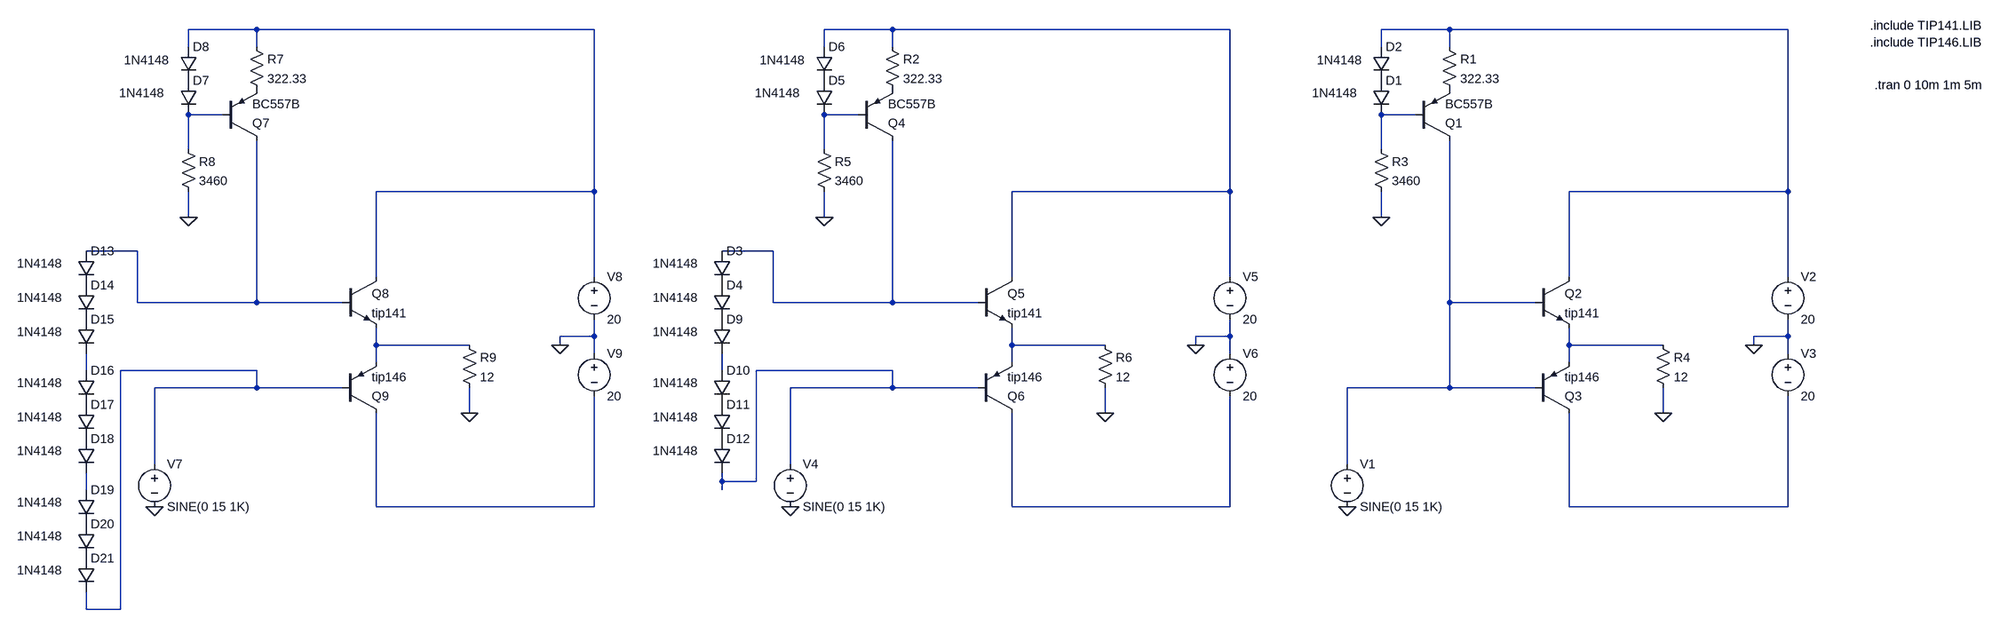
[diagram p0: schematic COMPARACION_DIODOS.asc]
COMPARACION_DIODOS.asc, the LTspice schematic file:
Version 4
SHEET 1 880 680
WIRE -3232 -512 -3360 -512
WIRE -2512 -512 -3232 -512
WIRE -1952 -512 -2080 -512
WIRE -1232 -512 -1952 -512
WIRE -688 -512 -816 -512
WIRE 32 -512 -688 -512
WIRE -3360 -480 -3360 -512
WIRE -3232 -480 -3232 -512
WIRE -2080 -480 -2080 -512
WIRE -1952 -480 -1952 -512
WIRE -816 -480 -816 -512
WIRE -688 -480 -688 -512
WIRE -3296 -352 -3360 -352
WIRE -2016 -352 -2080 -352
WIRE -752 -352 -816 -352
WIRE -3360 -288 -3360 -352
WIRE -2080 -288 -2080 -352
WIRE -816 -288 -816 -352
WIRE -2512 -208 -2512 -512
WIRE -2512 -208 -3008 -208
WIRE -1232 -208 -1232 -512
WIRE -1232 -208 -1728 -208
WIRE 32 -208 32 -512
WIRE 32 -208 -464 -208
WIRE -3360 -160 -3360 -208
WIRE -2080 -160 -2080 -208
WIRE -816 -160 -816 -208
WIRE -3456 -96 -3552 -96
WIRE -2176 -96 -2272 -96
WIRE -3008 -48 -3008 -208
WIRE -2512 -48 -2512 -208
WIRE -1728 -48 -1728 -208
WIRE -1232 -48 -1232 -208
WIRE -464 -48 -464 -208
WIRE 32 -48 32 -208
WIRE -3456 0 -3456 -96
WIRE -3232 0 -3232 -304
WIRE -3232 0 -3456 0
WIRE -3072 0 -3232 0
WIRE -2176 0 -2176 -96
WIRE -1952 0 -1952 -304
WIRE -1952 0 -2176 0
WIRE -1792 0 -1952 0
WIRE -688 0 -688 -304
WIRE -528 0 -688 0
WIRE -2512 64 -2512 32
WIRE -2512 64 -2576 64
WIRE -1232 64 -1232 32
WIRE -1232 64 -1296 64
WIRE 32 64 32 32
WIRE 32 64 -32 64
WIRE -3008 80 -3008 48
WIRE -2816 80 -3008 80
WIRE -2576 80 -2576 64
WIRE -1728 80 -1728 48
WIRE -1536 80 -1728 80
WIRE -1296 80 -1296 64
WIRE -464 80 -464 48
WIRE -272 80 -464 80
WIRE -32 80 -32 64
WIRE -2512 96 -2512 64
WIRE -1232 96 -1232 64
WIRE 32 96 32 64
WIRE -3008 112 -3008 80
WIRE -1728 112 -1728 80
WIRE -464 112 -464 80
WIRE -3552 128 -3552 96
WIRE -3232 128 -3488 128
WIRE -2272 128 -2272 96
WIRE -1952 128 -2208 128
WIRE -3232 160 -3232 128
WIRE -3232 160 -3424 160
WIRE -3072 160 -3232 160
WIRE -1952 160 -1952 128
WIRE -1952 160 -2144 160
WIRE -1792 160 -1952 160
WIRE -688 160 -688 0
WIRE -688 160 -880 160
WIRE -528 160 -688 160
WIRE -2816 208 -2816 160
WIRE -1536 208 -1536 160
WIRE -272 208 -272 160
WIRE -3424 304 -3424 160
WIRE -2144 304 -2144 160
WIRE -880 304 -880 160
WIRE -2272 336 -2272 320
WIRE -2208 336 -2208 128
WIRE -2208 336 -2272 336
WIRE -3552 352 -3552 320
WIRE -2272 352 -2272 336
WIRE -3008 384 -3008 208
WIRE -2512 384 -2512 176
WIRE -2512 384 -3008 384
WIRE -1728 384 -1728 208
WIRE -1232 384 -1232 176
WIRE -1232 384 -1728 384
WIRE -464 384 -464 208
WIRE 32 384 32 176
WIRE 32 384 -464 384
WIRE -3552 576 -3552 544
WIRE -3488 576 -3488 128
WIRE -3488 576 -3552 576
FLAG -816 -160 0
FLAG -880 384 0
FLAG -32 80 0
FLAG -272 208 0
FLAG -2080 -160 0
FLAG -2144 384 0
FLAG -1296 80 0
FLAG -1536 208 0
FLAG -3360 -160 0
FLAG -3424 384 0
FLAG -2576 80 0
FLAG -2816 208 0
SYMBOL diode -832 -416 R0
WINDOW 3 -114 23 Left 2
SYMATTR InstName D1
SYMATTR Value 1N4148
SYMBOL diode -832 -480 R0
WINDOW 3 -105 25 Left 2
SYMATTR InstName D2
SYMATTR Value 1N4148
SYMBOL res -704 -496 R0
SYMATTR InstName R1
SYMATTR Value 322.33
SYMBOL res -832 -304 R0
SYMATTR InstName R3
SYMATTR Value 3460
SYMBOL pnp -752 -304 M180
SYMATTR InstName Q1
SYMATTR Value BC557B
SYMBOL npn -528 -48 R0
SYMATTR InstName Q2
SYMATTR Value tip141
SYMATTR Prefix X
SYMBOL pnp -528 208 M180
SYMATTR InstName Q3
SYMATTR Value tip146
SYMATTR Prefix X
SYMBOL voltage -880 288 R0
WINDOW 123 0 0 Left 0
WINDOW 39 0 0 Left 0
SYMATTR InstName V1
SYMATTR Value SINE(0 15 1K)
SYMBOL voltage 32 -64 R0
WINDOW 123 0 0 Left 0
WINDOW 39 0 0 Left 0
SYMATTR InstName V2
SYMATTR Value 20
SYMBOL voltage 32 80 R0
WINDOW 123 0 0 Left 0
WINDOW 39 0 0 Left 0
SYMATTR InstName V3
SYMATTR Value 20
SYMBOL res -288 64 R0
SYMATTR InstName R4
SYMATTR Value 12
SYMBOL diode -2096 -416 R0
WINDOW 3 -114 23 Left 2
SYMATTR InstName D5
SYMATTR Value 1N4148
SYMBOL diode -2096 -480 R0
WINDOW 3 -105 25 Left 2
SYMATTR InstName D6
SYMATTR Value 1N4148
SYMBOL res -1968 -496 R0
SYMATTR InstName R2
SYMATTR Value 322.33
SYMBOL res -2096 -304 R0
SYMATTR InstName R5
SYMATTR Value 3460
SYMBOL pnp -2016 -304 M180
SYMATTR InstName Q4
SYMATTR Value BC557B
SYMBOL npn -1792 -48 R0
SYMATTR InstName Q5
SYMATTR Value tip141
SYMATTR Prefix X
SYMBOL pnp -1792 208 M180
SYMATTR InstName Q6
SYMATTR Value tip146
SYMATTR Prefix X
SYMBOL voltage -2144 288 R0
WINDOW 123 0 0 Left 0
WINDOW 39 0 0 Left 0
SYMATTR InstName V4
SYMATTR Value SINE(0 15 1K)
SYMBOL voltage -1232 -64 R0
WINDOW 123 0 0 Left 0
WINDOW 39 0 0 Left 0
SYMATTR InstName V5
SYMATTR Value 20
SYMBOL voltage -1232 80 R0
WINDOW 123 0 0 Left 0
WINDOW 39 0 0 Left 0
SYMATTR InstName V6
SYMATTR Value 20
SYMBOL res -1552 64 R0
SYMATTR InstName R6
SYMATTR Value 12
SYMBOL diode -2288 -96 R0
WINDOW 3 -114 23 Left 2
SYMATTR InstName D3
SYMATTR Value 1N4148
SYMBOL diode -2288 -32 R0
WINDOW 3 -114 23 Left 2
SYMATTR InstName D4
SYMATTR Value 1N4148
SYMBOL diode -2288 32 R0
WINDOW 3 -114 23 Left 2
SYMATTR InstName D9
SYMATTR Value 1N4148
SYMBOL diode -2288 128 R0
WINDOW 3 -114 23 Left 2
SYMATTR InstName D10
SYMATTR Value 1N4148
SYMBOL diode -2288 192 R0
WINDOW 3 -114 23 Left 2
SYMATTR InstName D11
SYMATTR Value 1N4148
SYMBOL diode -2288 256 R0
WINDOW 3 -114 23 Left 2
SYMATTR InstName D12
SYMATTR Value 1N4148
SYMBOL diode -3376 -416 R0
WINDOW 3 -114 23 Left 2
SYMATTR InstName D7
SYMATTR Value 1N4148
SYMBOL diode -3376 -480 R0
WINDOW 3 -105 25 Left 2
SYMATTR InstName D8
SYMATTR Value 1N4148
SYMBOL res -3248 -496 R0
SYMATTR InstName R7
SYMATTR Value 322.33
SYMBOL res -3376 -304 R0
SYMATTR InstName R8
SYMATTR Value 3460
SYMBOL pnp -3296 -304 M180
SYMATTR InstName Q7
SYMATTR Value BC557B
SYMBOL npn -3072 -48 R0
SYMATTR InstName Q8
SYMATTR Value tip141
SYMATTR Prefix X
SYMBOL pnp -3072 208 M180
SYMATTR InstName Q9
SYMATTR Value tip146
SYMATTR Prefix X
SYMBOL voltage -3424 288 R0
WINDOW 123 0 0 Left 0
WINDOW 39 0 0 Left 0
SYMATTR InstName V7
SYMATTR Value SINE(0 15 1K)
SYMBOL voltage -2512 -64 R0
WINDOW 123 0 0 Left 0
WINDOW 39 0 0 Left 0
SYMATTR InstName V8
SYMATTR Value 20
SYMBOL voltage -2512 80 R0
WINDOW 123 0 0 Left 0
WINDOW 39 0 0 Left 0
SYMATTR InstName V9
SYMATTR Value 20
SYMBOL res -2832 64 R0
SYMATTR InstName R9
SYMATTR Value 12
SYMBOL diode -3568 -96 R0
WINDOW 3 -114 23 Left 2
SYMATTR InstName D13
SYMATTR Value 1N4148
SYMBOL diode -3568 -32 R0
WINDOW 3 -114 23 Left 2
SYMATTR InstName D14
SYMATTR Value 1N4148
SYMBOL diode -3568 32 R0
WINDOW 3 -114 23 Left 2
SYMATTR InstName D15
SYMATTR Value 1N4148
SYMBOL diode -3568 128 R0
WINDOW 3 -114 23 Left 2
SYMATTR InstName D16
SYMATTR Value 1N4148
SYMBOL diode -3568 192 R0
WINDOW 3 -114 23 Left 2
SYMATTR InstName D17
SYMATTR Value 1N4148
SYMBOL diode -3568 256 R0
WINDOW 3 -114 23 Left 2
SYMATTR InstName D18
SYMATTR Value 1N4148
SYMBOL diode -3568 352 R0
WINDOW 3 -114 23 Left 2
SYMATTR InstName D19
SYMATTR Value 1N4148
SYMBOL diode -3568 416 R0
WINDOW 3 -114 23 Left 2
SYMATTR InstName D20
SYMATTR Value 1N4148
SYMBOL diode -3568 480 R0
WINDOW 3 -114 23 Left 2
SYMATTR InstName D21
SYMATTR Value 1N4148
TEXT 328 -408 Left 2 !.tran 0 10m 1m 5m
TEXT 320 -520 Left 2 !.include TIP141.LIB
TEXT 320 -488 Left 2 !.include TIP146.LIB

The netlist it stands for:
* COMPARACION_DIODOS.asc
D1 P001 N006 1N4148
D2 N003 P001 1N4148
R1 N003 P002 322.33
R3 N006 0 3460
Q1 N009 N006 P002 0 BC557B
XQ2 N003 N009 N012 tip141  ; pins C B E
XQ3 N020 N009 N012 tip146  ; pins C B E
V1 N009 0 SINE(0 15 1K)
V2 N003 0 20
V3 0 N020 20
R4 N012 0 12
D5 P003 N005 1N4148
D6 N002 P003 1N4148
R2 N002 P004 322.33
R5 N005 0 3460
Q4 N008 N005 P004 0 BC557B
XQ5 N002 N008 N011 tip141  ; pins C B E
XQ6 N019 N016 N011 tip146  ; pins C B E
V4 N016 0 SINE(0 15 1K)
V5 N002 0 20
V6 0 N019 20
R6 N011 0 12
D3 N008 P005 1N4148
D4 P005 P006 1N4148
D9 P006 N015 1N4148
D10 N015 P007 1N4148
D11 P007 P008 1N4148
D12 P008 N016 1N4148
D7 P009 N004 1N4148
D8 N001 P009 1N4148
R7 N001 P010 322.33
R8 N004 0 3460
Q7 N007 N004 P010 0 BC557B
XQ8 N001 N007 N010 tip141  ; pins C B E
XQ9 N018 N014 N010 tip146  ; pins C B E
V7 N014 0 SINE(0 15 1K)
V8 N001 0 20
V9 0 N018 20
R9 N010 0 12
D13 N007 P011 1N4148
D14 P011 P012 1N4148
D15 P012 N013 1N4148
D16 N013 P013 1N4148
D17 P013 P014 1N4148
D18 P014 N017 1N4148
D19 N017 P015 1N4148
D20 P015 P016 1N4148
D21 P016 N014 1N4148
.model D D
.lib standard.dio
.model NPN NPN
.model PNP PNP
.lib standard.bjt
.tran 0 10m 1m 5m
.include TIP141.LIB
.include TIP146.LIB
.backanno
.end